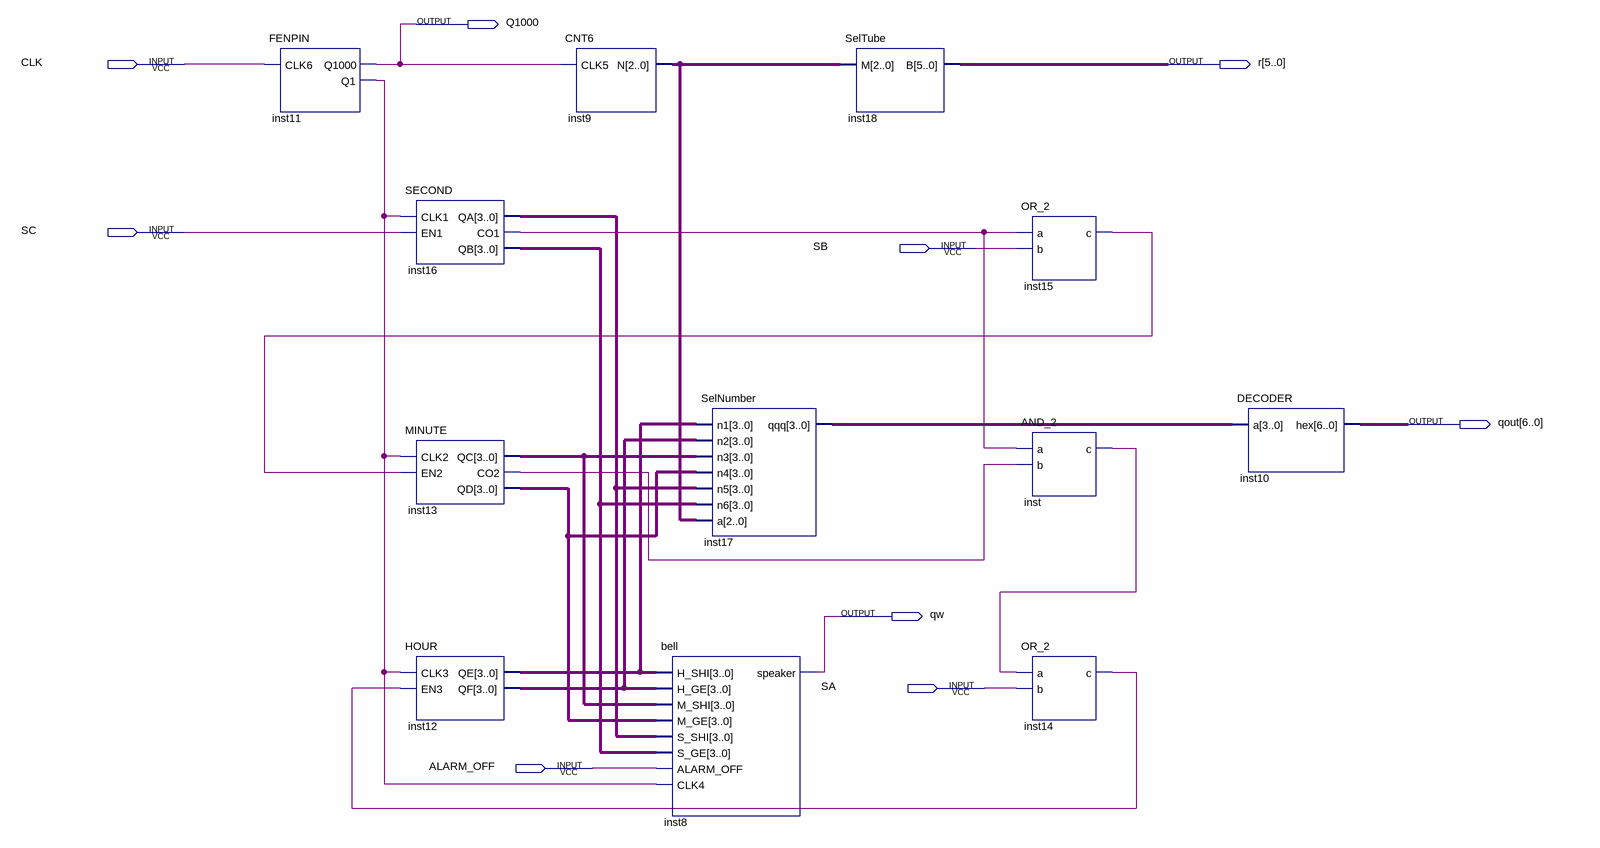
[diagram p0: schematic sheet]
// Quartus schematic BEEL_E_CLOCK.bdf as structural Verilog: 12 symbols, 9 pins
module BEEL_E_CLOCK (
  input  CLK,
  input  SC,
  input  SB,
  input  SA,
  input  ALARM_OFF,
  output Q1000,
  output [5:0] r,
  output [6:0] qout,
  output qw
);

  wire inst11_q1, inst13_co2, inst14_c, inst15_c, inst16_co1, inst_c;
  wire [2:0] inst9_n;
  wire [3:0] inst12_qe, inst12_qf, inst13_qc, inst13_qd, inst16_qa, inst16_qb, inst17_qqq;

  FENPIN inst11 (.CLK6(CLK), .Q1000(Q1000), .Q1(inst11_q1));
  SECOND inst16 (.CLK1(inst11_q1), .EN1(SC), .QA(inst16_qa), .CO1(inst16_co1), .QB(inst16_qb));
  MINUTE inst13 (.CLK2(inst11_q1), .EN2(inst15_c), .QC(inst13_qc), .CO2(inst13_co2), .QD(inst13_qd));
  HOUR inst12 (.CLK3(inst11_q1), .EN3(inst14_c), .QE(inst12_qe), .QF(inst12_qf));
  CNT6 inst9 (.CLK5(Q1000), .N(inst9_n));
  SelNumber inst17 (
    .n1(inst12_qe), .n2(inst12_qf), .n3(inst13_qc), .n4(inst13_qd), .n5(inst16_qa), .n6(inst16_qb),
    .a(inst9_n), .qqq(inst17_qqq));
  bell inst8 (
    .H_SHI(inst12_qe), .H_GE(inst12_qf), .M_SHI(inst13_qc), .M_GE(inst13_qd), .S_SHI(inst16_qa),
    .S_GE(inst16_qb), .ALARM_OFF(ALARM_OFF), .CLK4(inst11_q1), .speaker(qw));
  SelTube inst18 (.M(inst9_n), .B(r));
  OR_2 inst15 (.a(inst16_co1), .b(SB), .c(inst15_c));
  AND_2 inst (.a(inst16_co1), .b(inst13_co2), .c(inst_c));
  OR_2 inst14 (.a(inst_c), .b(SA), .c(inst14_c));
  DECODER inst10 (.a(inst17_qqq), .hex(qout));
endmodule
